# Altium schematic sheet KelvinVoltageMeasureModule.SchDoc
size A3; SheetNumber: 2; SheetTotal: 10
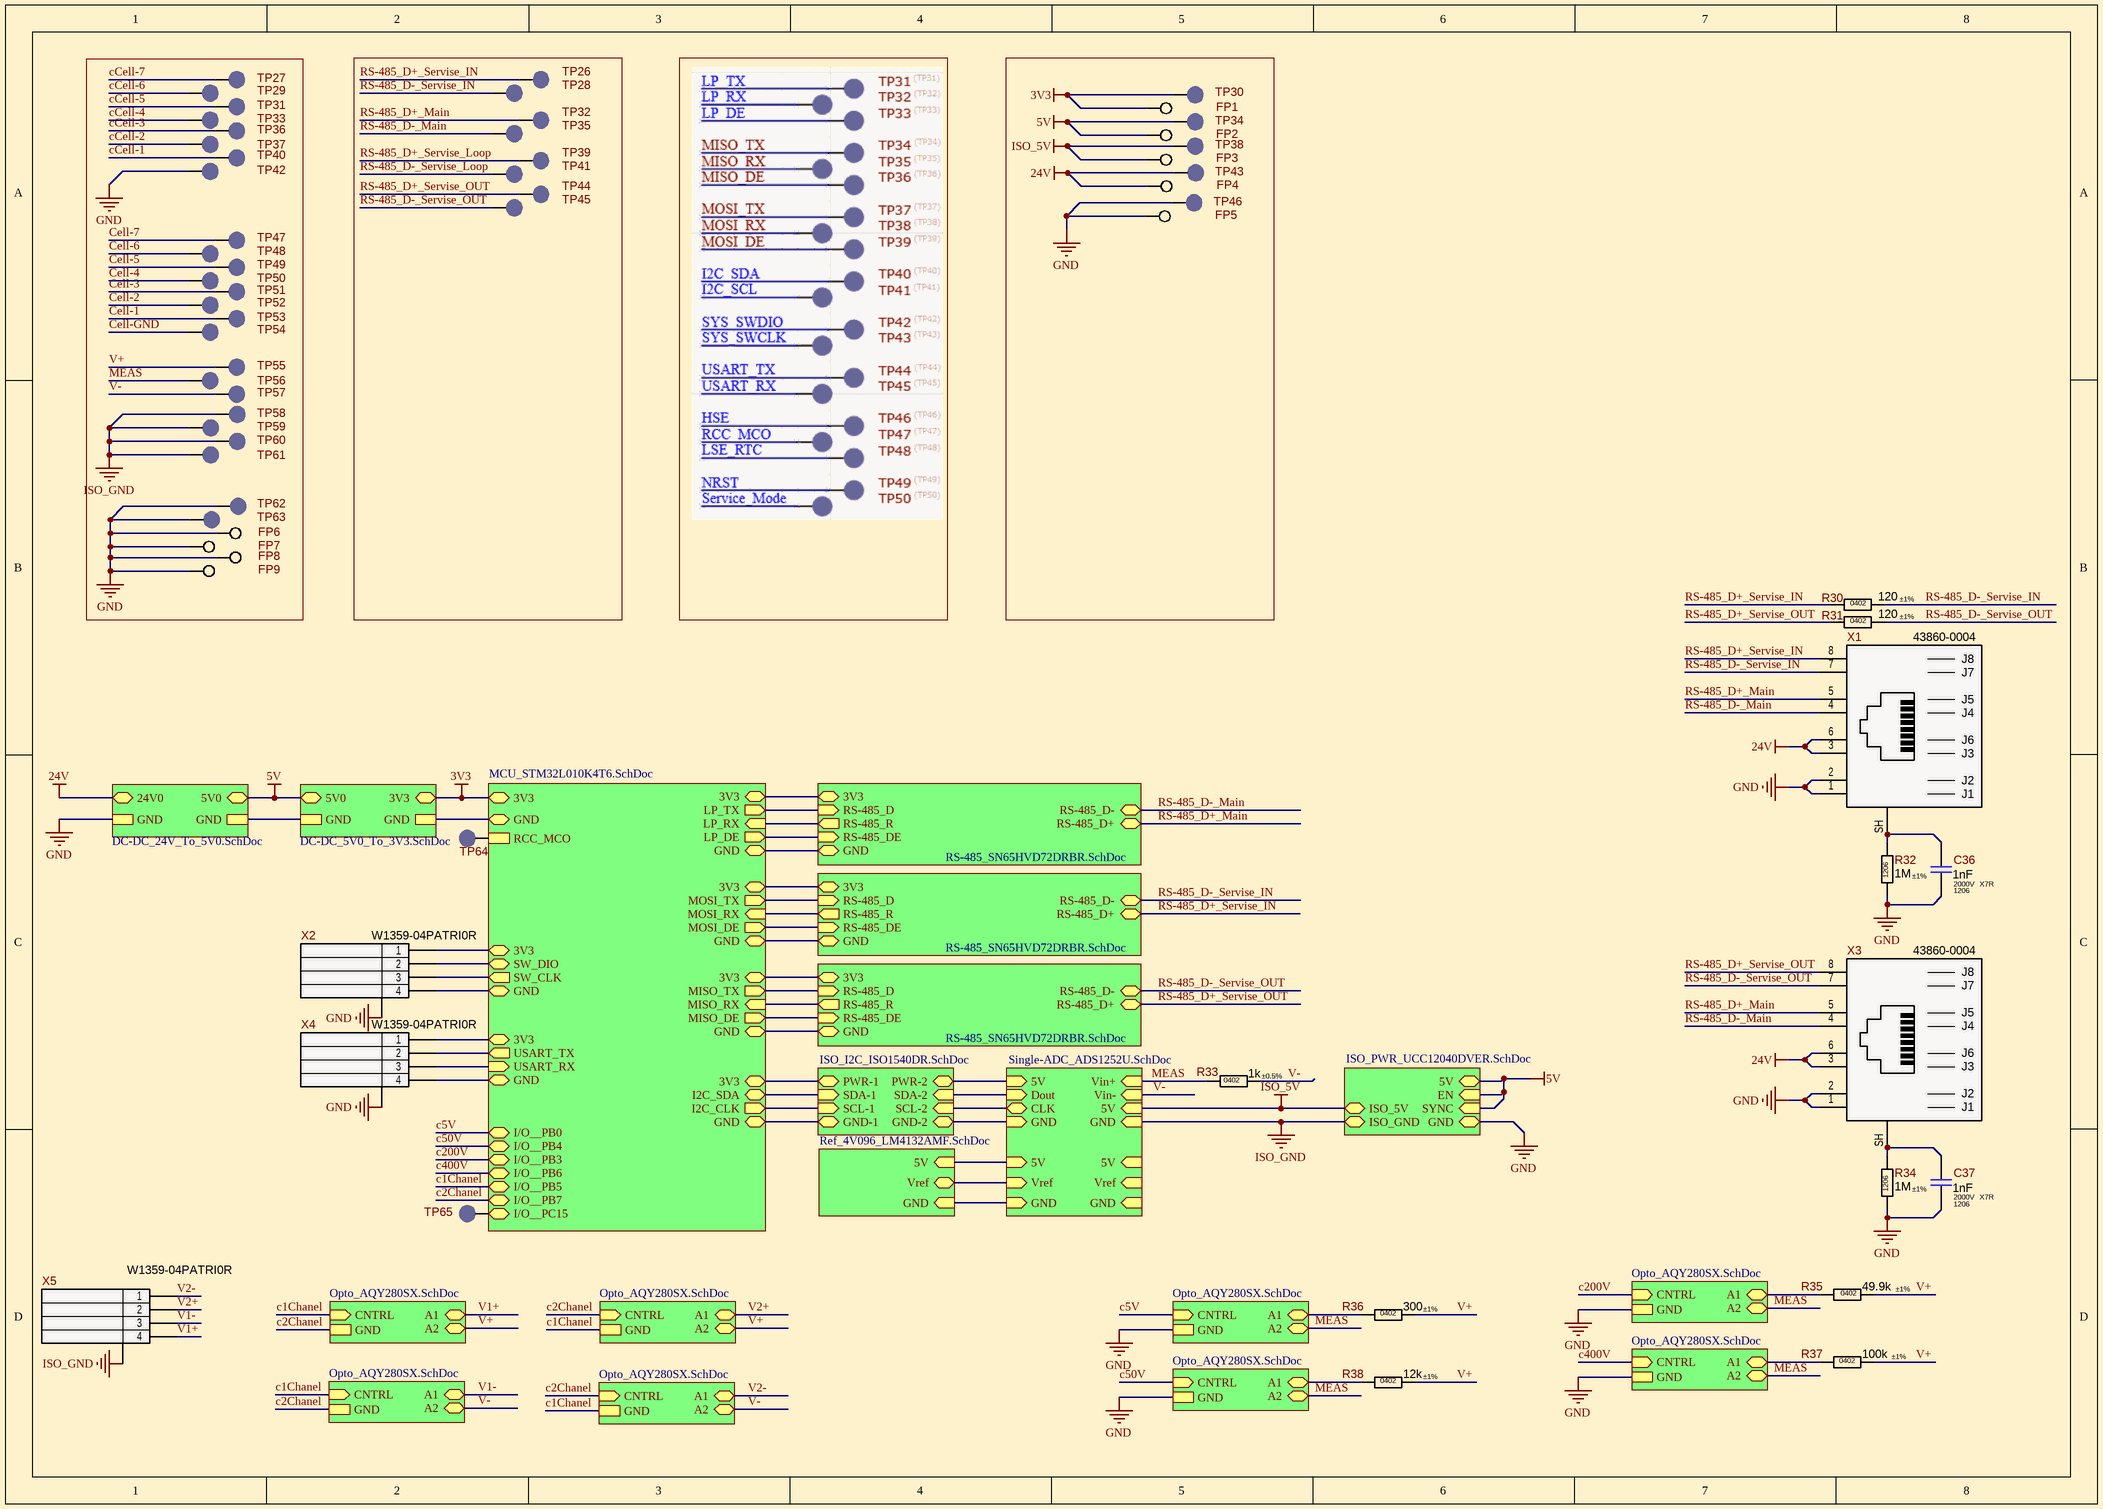
[diagram p0: KelvinVoltageMeasureModule.SchDoc]

## Parts
C36  Package: 1206  Voltage: 2000V  Dielectric Type: X7R  [CAP-1206(3216)X125T20]  (hidden comment: 1nF)
C37  Package: 1206  Voltage: 2000V  Dielectric Type: X7R  [CAP-1206(3216)X125T20]  (hidden comment: 1nF)
FP1  PAD-1.1mm  [PAD-1.1mm]  (value not drawn)  (no BOM)
FP2  PAD-1.1mm  [PAD-1.1mm]  (value not drawn)  (no BOM)
FP3  PAD-1.1mm  [PAD-1.1mm]  (value not drawn)  (no BOM)
FP4  PAD-1.1mm  [PAD-1.1mm]  (value not drawn)  (no BOM)
FP5  PAD-1.1mm  [PAD-1.1mm]  (value not drawn)  (no BOM)
FP6  PAD-1.1mm  [PAD-1.1mm]  (value not drawn)  (no BOM)
FP7  PAD-1.1mm  [PAD-1.1mm]  (value not drawn)  (no BOM)
FP8  PAD-1.1mm  [PAD-1.1mm]  (value not drawn)  (no BOM)
FP9  PAD-1.1mm  [PAD-1.1mm]  (value not drawn)  (no BOM)
R30  Tolerance: ±1%  Package: 0402  [R_ANY_CHIP_0402_HI]  (hidden comment: 120)
R31  Tolerance: ±1%  Package: 0402  [R_ANY_CHIP_0402_HI]  (hidden comment: 120)
R32  Tolerance: ±1%  Package: 1206  [CHV1206-Series]  (hidden comment: 1M)
R33  Tolerance: ±0.5%  Package: 0402  [R_ANY_CHIP_0402_MED]  (hidden comment: 1k)
R34  Tolerance: ±1%  Package: 1206  [CHV1206-Series]  (hidden comment: 1M)
R35  Tolerance: ±1%  Package: 0402  [R_ANY_CHIP_0402_MED]  (hidden comment: 49.9k)
R36  Tolerance: ±1%  Package: 0402  [R_ANY_CHIP_0402_MED]  (hidden comment: 300)
R37  Tolerance: ±1%  Package: 0402  [R_ANY_CHIP_0402_MED]  (hidden comment: 100k)
R38  Tolerance: ±1%  Package: 0402  [R_ANY_CHIP_0402_MED]  (hidden comment: 12k)
TP26  LED_LINK  [TP_SMD_2mm]  (value not drawn)  (no BOM)
TP27  LED_LINK  [TP_SMD_2mm]  (value not drawn)  (no BOM)
TP28  LED_LINK  [TP_SMD_2mm]  (value not drawn)  (no BOM)
TP29  LED_LINK  [TP_SMD_2mm]  (value not drawn)  (no BOM)
TP30  LED_LINK  [TP_SMD_2mm]  (value not drawn)  (no BOM)
TP31  LED_LINK  [TP_SMD_2mm]  (value not drawn)  (no BOM)
TP32  LED_LINK  [TP_SMD_2mm]  (value not drawn)  (no BOM)
TP33  LED_LINK  [TP_SMD_2mm]  (value not drawn)  (no BOM)
TP34  LED_LINK  [TP_SMD_2mm]  (value not drawn)  (no BOM)
TP35  LED_LINK  [TP_SMD_2mm]  (value not drawn)  (no BOM)
TP36  LED_LINK  [TP_SMD_2mm]  (value not drawn)  (no BOM)
TP37  LED_LINK  [TP_SMD_2mm]  (value not drawn)  (no BOM)
TP38  LED_LINK  [TP_SMD_2mm]  (value not drawn)  (no BOM)
TP39  LED_LINK  [TP_SMD_2mm]  (value not drawn)  (no BOM)
TP40  LED_LINK  [TP_SMD_2mm]  (value not drawn)  (no BOM)
TP41  LED_LINK  [TP_SMD_2mm]  (value not drawn)  (no BOM)
TP42  LED_LINK  [TP_SMD_2mm]  (value not drawn)  (no BOM)
TP43  LED_LINK  [TP_SMD_2mm]  (value not drawn)  (no BOM)
TP44  LED_LINK  [TP_SMD_2mm]  (value not drawn)  (no BOM)
TP45  LED_LINK  [TP_SMD_2mm]  (value not drawn)  (no BOM)
TP46  LED_LINK  [TP_SMD_2mm]  (value not drawn)  (no BOM)
TP47  LED_LINK  [TP_SMD_2mm]  (value not drawn)  (no BOM)
TP48  LED_LINK  [TP_SMD_2mm]  (value not drawn)  (no BOM)
TP49  LED_LINK  [TP_SMD_2mm]  (value not drawn)  (no BOM)
TP50  LED_LINK  [TP_SMD_2mm]  (value not drawn)  (no BOM)
TP51  LED_LINK  [TP_SMD_2mm]  (value not drawn)  (no BOM)
TP52  LED_LINK  [TP_SMD_2mm]  (value not drawn)  (no BOM)
TP53  LED_LINK  [TP_SMD_2mm]  (value not drawn)  (no BOM)
TP54  LED_LINK  [TP_SMD_2mm]  (value not drawn)  (no BOM)
TP55  LED_LINK  [TP_SMD_2mm]  (value not drawn)  (no BOM)
TP56  LED_LINK  [TP_SMD_2mm]  (value not drawn)  (no BOM)
TP57  LED_LINK  [TP_SMD_2mm]  (value not drawn)  (no BOM)
TP58  LED_LINK  [TP_SMD_2mm]  (value not drawn)  (no BOM)
TP59  LED_LINK  [TP_SMD_2mm]  (value not drawn)  (no BOM)
TP60  LED_LINK  [TP_SMD_2mm]  (value not drawn)  (no BOM)
TP61  LED_LINK  [TP_SMD_2mm]  (value not drawn)  (no BOM)
TP62  LED_LINK  [TP_SMD_2mm]  (value not drawn)  (no BOM)
TP63  LED_LINK  [TP_SMD_2mm]  (value not drawn)  (no BOM)
TP64  LED_LINK  [TP_SMD_2mm]  (value not drawn)  (no BOM)
TP65  LED_LINK  [TP_SMD_2mm]  (value not drawn)  (no BOM)
X1  43860-0004  [43860-0004]
X2  W1359-04PATRI0R  [W1359-04PATXI0R_DBG]
X3  43860-0004  [43860-0004]
X4  W1359-04PATRI0R  [W1359-04PATXI0R_DBG]
X5  W1359-04PATRI0R  [W1359-04PATXI0R_DBG]

## Sub-sheets
ADC = Single-ADC_ADS1252U.SchDoc: Vin+ (in), CLK (bidir), Vin- (in), 5V (in), GND (in), Dout (in), 5V (in), GND (in), 5V (in), 5V (in), Vref (in), Vref (in), GND (in), GND (in)
CellSelectModule = Opto_AQY280SX.SchDoc: CNTRL (in), A1 (bidir), A2 (bidir), GND
CellSelectModule = Opto_AQY280SX.SchDoc: CNTRL (in), A1 (bidir), A2 (bidir), GND
CellSelectModule = Opto_AQY280SX.SchDoc: CNTRL (in), A1 (bidir), A2 (bidir), GND
CellSelectModule = Opto_AQY280SX.SchDoc: CNTRL (in), A1 (bidir), A2 (bidir), GND
CellSelectModule = Opto_AQY280SX.SchDoc: CNTRL (in), A1 (bidir), A2 (bidir), GND
CellSelectModule = Opto_AQY280SX.SchDoc: CNTRL (in), A1 (bidir), A2 (bidir), GND
CellSelectModule = Opto_AQY280SX.SchDoc: CNTRL (in), A1 (bidir), A2 (bidir), GND
CellSelectModule = Opto_AQY280SX.SchDoc: CNTRL (in), A1 (bidir), A2 (bidir), GND
ISO_5V = ISO_PWR_UCC12040DVER.SchDoc: ISO_5V (bidir), 5V (bidir), GND (bidir), ISO_GND (bidir), EN (in), SYNC (in)
ISO_I2C = ISO_I2C_ISO1540DR.SchDoc: PWR-2 (bidir), PWR-1 (bidir), GND-1 (bidir), GND-2 (bidir), SDA-1 (in), SCL-1 (in), SDA-2 (in), SCL-2 (in)
ISO_I2C = Ref_4V096_LM4132AMF.SchDoc: Vref (bidir), 5V (in), GND (in)
LDO_3V3 = DC-DC_5V0_To_3V3.SchDoc: 3V3 (bidir), 5V0 (bidir), GND, GND
LDO_3V3 = DC-DC_24V_To_5V0.SchDoc: 5V0 (bidir), 24V0 (bidir), GND, GND
MCU = MCU_STM32L010K4T6.SchDoc: LP_TX (out), LP_RX (in), LP_DE (out), MISO_TX (out), MISO_RX (in), MISO_DE (out), MOSI_RX (in), MOSI_TX (out), MOSI_DE (out), I2C_SDA (bidir), I2C_CLK (out), SW_DIO (bidir), SW_CLK (out), USART_TX (out), USART_RX (in), RCC_MCO, I/O__PB0 (bidir), I/O__PB3 (bidir), I/O__PB4 (bidir), I/O__PB5 (bidir), I/O__PB6 (bidir), I/O__PB7 (bidir), I/O__PC15 (bidir), 3V3 (bidir), 3V3 (bidir), 3V3 (bidir), 3V3 (bidir), 3V3 (bidir), GND (bidir), GND (bidir), GND (bidir), GND (bidir), GND (bidir), GND (bidir), GND (bidir), 3V3 (bidir), 3V3 (bidir)
RS-485 = RS-485_SN65HVD72DRBR.SchDoc: 3V3 (bidir), RS-485_D+ (bidir), RS-485_D- (bidir), RS-485_R (out), RS-485_D (in), RS-485_DE (in), GND (bidir)
RS-485 = RS-485_SN65HVD72DRBR.SchDoc: 3V3 (bidir), RS-485_D+ (bidir), RS-485_D- (bidir), RS-485_R (out), RS-485_D (in), RS-485_DE (in), GND (bidir)
RS-485 = RS-485_SN65HVD72DRBR.SchDoc: 3V3 (bidir), RS-485_D+ (bidir), RS-485_D- (bidir), RS-485_R (out), RS-485_D (in), RS-485_DE (in), GND (bidir)

## Nets
3V3: FP1.1 TP30.1 ; sheet LDO_3V3/3V3, sheet MCU/3V3
5V: FP2.1 TP34.1 ; sheet LDO_3V3/5V0, sheet ISO_5V/5V, sheet ISO_5V/EN, sheet ISO_5V/SYNC, sheet LDO_3V3/5V0
24V: FP4.1 TP43.1 X1.3(TD3-) X1.6(CT) X3.3(TD3-) X3.6(CT) ; sheet LDO_3V3/24V0
GND: C36.2 C37.2 FP5.1 FP6.1 FP7.1 FP8.1 FP9.1 R32.2 R34.2 TP42.1 TP46.1 TP62.1 TP63.1 X1.1(TD4-) X1.2(TD4+) X2.MP(MountPad) X3.1(TD4-) X3.2(TD4+) X4.MP(MountPad) ; sheet ISO_5V/GND, sheet LDO_3V3/GND, sheet CellSelectModule/GND, sheet CellSelectModule/GND, sheet CellSelectModule/GND, sheet CellSelectModule/GND
ISO_5V: FP3.1 TP38.1 ; sheet ISO_5V/ISO_5V, sheet ADC/5V
ISO_GND: TP58.1 TP59.1 TP60.1 TP61.1 X5.MP(MountPad) ; sheet ISO_5V/ISO_GND, sheet ADC/GND
c1Chanel: sheet MCU/I/O__PB5, sheet CellSelectModule/CNTRL, sheet CellSelectModule/CNTRL, sheet CellSelectModule/GND, sheet CellSelectModule/GND
c2Chanel: sheet MCU/I/O__PB7, sheet CellSelectModule/GND, sheet CellSelectModule/GND, sheet CellSelectModule/CNTRL, sheet CellSelectModule/CNTRL
c5V: sheet MCU/I/O__PB0, sheet CellSelectModule/CNTRL
c50V: sheet MCU/I/O__PB4, sheet CellSelectModule/CNTRL
c200V: sheet MCU/I/O__PB3, sheet CellSelectModule/CNTRL
c400V: sheet MCU/I/O__PB6, sheet CellSelectModule/CNTRL
cCell-1: TP40.1
cCell-2: TP37.1
cCell-3: TP36.1
cCell-4: TP33.1
cCell-5: TP31.1
cCell-6: TP29.1
cCell-7: TP27.1
Cell-1: TP53.1
Cell-2: TP52.1
Cell-3: TP51.1
Cell-4: TP50.1
Cell-5: TP49.1
Cell-6: TP48.1
Cell-7: TP47.1
Cell-GND: TP54.1
MEAS: R33.1 TP56.1 ; sheet ADC/Vin+, sheet CellSelectModule/A2, sheet CellSelectModule/A2, sheet CellSelectModule/A2, sheet CellSelectModule/A2
RS-485_D+_Main: TP32.1 X1.5(CT) X3.5(CT) ; sheet RS-485/RS-485_D+
RS-485_D+_Servise_IN: R30.1 TP26.1 X1.8(TD2+) ; sheet RS-485/RS-485_D+
RS-485_D+_Servise_Loop: TP39.1
RS-485_D+_Servise_OUT: R31.1 TP44.1 X3.8(TD2+) ; sheet RS-485/RS-485_D+
RS-485_D-_Main: TP35.1 X1.4(TD3+) X3.4(TD3+) ; sheet RS-485/RS-485_D-
RS-485_D-_Servise_IN: R30.2 TP28.1 X1.7(TD2-) ; sheet RS-485/RS-485_D-
RS-485_D-_Servise_Loop: TP41.1
RS-485_D-_Servise_OUT: R31.2 TP45.1 X3.7(TD2-) ; sheet RS-485/RS-485_D-
V1+: X5.4 ; sheet CellSelectModule/A1
V1-: X5.3 ; sheet CellSelectModule/A1
V2+: X5.2 ; sheet CellSelectModule/A1
V2-: X5.1 ; sheet CellSelectModule/A1
V+: R35.1 R36.1 R37.1 R38.1 TP55.1 ; sheet CellSelectModule/A2, sheet CellSelectModule/A2
V-: R33.2 TP57.1 ; sheet ADC/Vin-, sheet CellSelectModule/A2, sheet CellSelectModule/A2
NetC36_1: C36.1 R32.1 X1.SH(Shield)
NetC37_1: C37.1 R34.1 X3.SH(Shield)
NetR35_2: R35.2 ; sheet CellSelectModule/A1
NetR36_2: R36.2 ; sheet CellSelectModule/A1
NetR37_2: R37.2 ; sheet CellSelectModule/A1
NetR38_2: R38.2 ; sheet CellSelectModule/A1
NetTP64_1: TP64.1 ; sheet MCU/RCC_MCO
NetTP65_1: TP65.1 ; sheet MCU/I/O__PC15
NetX2_1: X2.1 ; sheet MCU/3V3
NetX2_2: X2.2 ; sheet MCU/SW_DIO
NetX2_3: X2.3 ; sheet MCU/SW_CLK
NetX2_4: X2.4 ; sheet MCU/GND
NetX4_1: X4.1 ; sheet MCU/3V3
NetX4_2: X4.2 ; sheet MCU/USART_TX
NetX4_3: X4.3 ; sheet MCU/USART_RX
NetX4_4: X4.4 ; sheet MCU/GND
(unnamed): sheet LDO_3V3/GND, sheet MCU/GND
(unnamed): sheet LDO_3V3/GND, sheet LDO_3V3/GND
(unnamed): sheet ISO_I2C/PWR-2, sheet ADC/5V
(unnamed): sheet ISO_I2C/PWR-1, sheet MCU/3V3
(unnamed): sheet ISO_I2C/GND-1, sheet MCU/GND
(unnamed): sheet ISO_I2C/GND-2, sheet ADC/GND
(unnamed): sheet ISO_I2C/SDA-1, sheet MCU/I2C_SDA
(unnamed): sheet ISO_I2C/SCL-1, sheet MCU/I2C_CLK
(unnamed): sheet ISO_I2C/SDA-2, sheet ADC/Dout
(unnamed): sheet ISO_I2C/SCL-2, sheet ADC/CLK
(unnamed): sheet MCU/LP_TX, sheet RS-485/RS-485_D
(unnamed): sheet MCU/LP_RX, sheet RS-485/RS-485_R
(unnamed): sheet MCU/LP_DE, sheet RS-485/RS-485_DE
(unnamed): sheet MCU/MISO_TX, sheet RS-485/RS-485_D
(unnamed): sheet MCU/MISO_RX, sheet RS-485/RS-485_R
(unnamed): sheet MCU/MISO_DE, sheet RS-485/RS-485_DE
(unnamed): sheet MCU/MOSI_RX, sheet RS-485/RS-485_R
(unnamed): sheet MCU/MOSI_TX, sheet RS-485/RS-485_D
(unnamed): sheet MCU/MOSI_DE, sheet RS-485/RS-485_DE
(unnamed): sheet MCU/3V3, sheet RS-485/3V3
(unnamed): sheet MCU/3V3, sheet RS-485/3V3
(unnamed): sheet MCU/GND, sheet RS-485/GND
(unnamed): sheet MCU/GND, sheet RS-485/GND
(unnamed): sheet MCU/GND, sheet RS-485/GND
(unnamed): sheet MCU/3V3, sheet RS-485/3V3
(unnamed): sheet ADC/5V, sheet ISO_I2C/5V
(unnamed): sheet ADC/Vref, sheet ISO_I2C/Vref
(unnamed): sheet ADC/GND, sheet ISO_I2C/GND

## Notes on the sheet
- (in symbol 43860-0004) J8; J7; J5; J4; J6; J3; J2; J1

## Library data of the parts
C36 C37 = Capacitor-NonPolar: 1nF 2000V X7R ±10% 1206 Ceramic Capacitor RoHS; Part Number: CC1206KKX7RDBB102; Manufacturer: Yageo; Replacement: NONE; Value: 1nF; Part Type: Ceramic / X7R / 1206; Component Type: SMD; Temperature Range: -55°C ~ 125°C; Tolerance: ±10%; ComponentLink1URL: https://www.yageo.com/upload/media/product/products/datasheet/mlcc/UPY-NP0X7R_HV_1KV-to-3KV_11.pdf; Supplier 1: Digi-Key; Supplier Part Number 1: 311-1487-2-ND; ComponentLink1Description: Datasheet
FP1-FP9 = Pad: 1.1mm Pad for Plug-In or Receptacle; Manufacturer: NONE; Component Status: Released; Part Number: PAD-1.1mm; Component Type: PTH; Part Type: Pad; Temperature Range: NONE; ComponentLink1URL: NONE; Replacement: NONE; ComponentLink1Description: Datasheet; Price: NONE
R30 R31 = Resistor: 120 Ohms ±1% 1/16W 0402 Thick Film Resistor; Part Number: RC0402FR-07120RL; Manufacturer: Yageo; Power Rating: 0.062W; Voltage: 50V; Component Status: Released; Temperature Stability: ±100ppm/°C; Replacement: NONE; Value: 120; Component Type: SMD; Part Type: Thick Film; Temperature Range: -55°C ~ 155°C; ComponentLink1URL: https://eu.mouser.com/datasheet/2/447/PYu_RC_Group_51_RoHS_L_10-1664068.pdf; Price: 0.00065; ComponentLink1Description: Datasheet
R32 R34 = Resistor: 1 MOhms ±1%, 1/4W 1206 Thick Film Resistor; Part Number: CHV1206-FX-1004ELF; Manufacturer: Bourns; Power Rating: 0.25W; Voltage: 800V; Component Status: Released; Temperature Stability: ±100ppm/°C; Replacement: NONE; Value: 1M; Component Type: SMD; Part Type: Thick Film; Temperature Range: -55°C ~ 155°C; ComponentLink1URL: https://eu.mouser.com/datasheet/2/54/CHV-777595.pdf; Supplier 1: Mouser; Supplier Part Number 1: 652-CHV1206FX1004ELF; Price: 0.0173216; ComponentLink1Description: Datasheet
R33 = Resistor: 1 kOhms ±0.5% 1/16W 0402 Thick Film Resistor; Part Number: RC0402DR-071KL; Manufacturer: Yageo; Power Rating: 0.062W; Voltage: 50V; Component Status: Released; Temperature Stability: ±100ppm/°C; Replacement: NONE; Value: 1k; Component Type: SMD; Part Type: Thick Film; Temperature Range: -55°C ~ 155°C; ComponentLink1URL: https://www.yageo.com/upload/media/product/productsearch/datasheet/rchip/PYu-RC_Group_51_RoHS_L_12.pdf; Supplier 1: Digi-Key; Supplier Part Number 1: 13-RC0402DR-071KLTR-ND; Price: 0.015; ComponentLink1Description: Datasheet
R35 = RC0402FR-0749K9L: 49.9 kOhms ±1% 1/16W 0402 Thick Film Resistor; Manufacturer: Yageo; Power Rating: 0.062W; Voltage: 50V; Component Status: Released; Temperature Stability: ±100ppm/°C; Replacement: NONE; Part Number: RC0402FR-0749K9L; Component Type: SMD; Part Type: Thick Film; Temperature Range: -55°C ~ 155°C; ComponentLink1URL: https://eu.mouser.com/datasheet/2/447/PYu_RC_Group_51_RoHS_L_10-1664068.pdf; Supplier 1: Mouser; Supplier Part Number 1: 603-RC0402FR-0749K9L; Price: 0.00065; ComponentLink1Description: Datasheet; Value: 49.9k
R36 = RC0402FR-07300RL: 300 Ohms ±1% 1/16W 0402 Thick Film Resistor; Manufacturer: Yageo; Power Rating: 0.062W; Voltage: 50V; Component Status: Released; Temperature Stability: ±100ppm/°C; Replacement: NONE; Part Number: RC0402FR-07300RL; Component Type: SMD; Part Type: Thick Film; Temperature Range: -55°C ~ 155°C; ComponentLink1URL: https://eu.mouser.com/datasheet/2/447/PYu_RC_Group_51_RoHS_L_10-1664068.pdf; Price: 0.00065; ComponentLink1Description: Datasheet; Value: 300
R37 = RC0402FR-07100KL: 100 kOhms ±1% 1/16W 0402 Thick Film Resistor; Manufacturer: Yageo; Power Rating: 0.062W; Voltage: 50V; Component Status: Released; Temperature Stability: ±100ppm/°C; Replacement: NONE; Part Number: RC0402FR-07100KL; Component Type: SMD; Part Type: Thick Film; Temperature Range: -55°C ~ 155°C; ComponentLink1URL: https://eu.mouser.com/datasheet/2/447/PYu_RC_Group_51_RoHS_L_10-1664068.pdf; Supplier 1: Digi-Key; Supplier Part Number 1: 311-100KLRTR-ND; Price: 0.00065; ComponentLink1Description: Datasheet; Value: 100k
R38 = RC0402FR-0712KL: 12 kOhms ±1% 1/16W 0402 Thick Film Resistor; Manufacturer: Yageo; Power Rating: 0.062W; Voltage: 50V; Component Status: Released; Temperature Stability: ±100ppm/°C; Replacement: NONE; Part Number: RC0402FR-0712KL; Component Type: SMD; Part Type: Thick Film; Temperature Range: -55°C ~ 155°C; ComponentLink1URL: https://eu.mouser.com/datasheet/2/447/PYu_RC_Group_51_RoHS_L_11-1984063.pdf; Supplier 1: Digi-Key; Supplier Part Number 1: 311-12.0KLRTR-ND; Price: 0.00065003; ComponentLink1Description: Datasheet; Value: 12k
TP26-TP65 = Test-Point-SMD-1: Test Point SMD Pad 1.0mm/1.5mm/2mm; Part Number: TP-PAD-SMD; Replacement: NONE; Part Type: Test Point; Component Type: SMD; Temperature Range: NONE; ComponentLink1URL: NONE; ComponentLink1Description: Datasheet
X1 X3 = 43860-0004: RJ45 8P8C Shielded Cat 3 10 Base-T Connector; Manufacturer: Molex; Component Status: Released; Replacement: NONE; Part Number: 43860-0004; Part Type: RJ-45; Component Type: PTH; Temperature Range: -40°C ~ 85°C; ComponentLink1URL: https://www.molex.com/pdm_docs/sd/438600004_sd.pdf; Supplier 1: Mouser; Supplier Part Number 1: 538-43860-0004; Price: 2.1435; ComponentLink1Description: Datasheet
X2 X4 X5 = General-4-Pin-MP: 1.25mm Wire-to-Board Header, Vertical, SMT, 4 pin; Manufacturer: Hsuan Mao Technology; Component Status: Released; Replacement: 53398-0471; Part Number: W1359-04PATRI0R; Part Type: Wire-to-Board / 1.25mm; Component Type: SMD; Temperature Range: -40°C ~ 85°C; Price: 0.06